# Altium schematic sheet 12V_REG.SchDoc
size A4; SheetNumber: 5; SheetTotal: 9
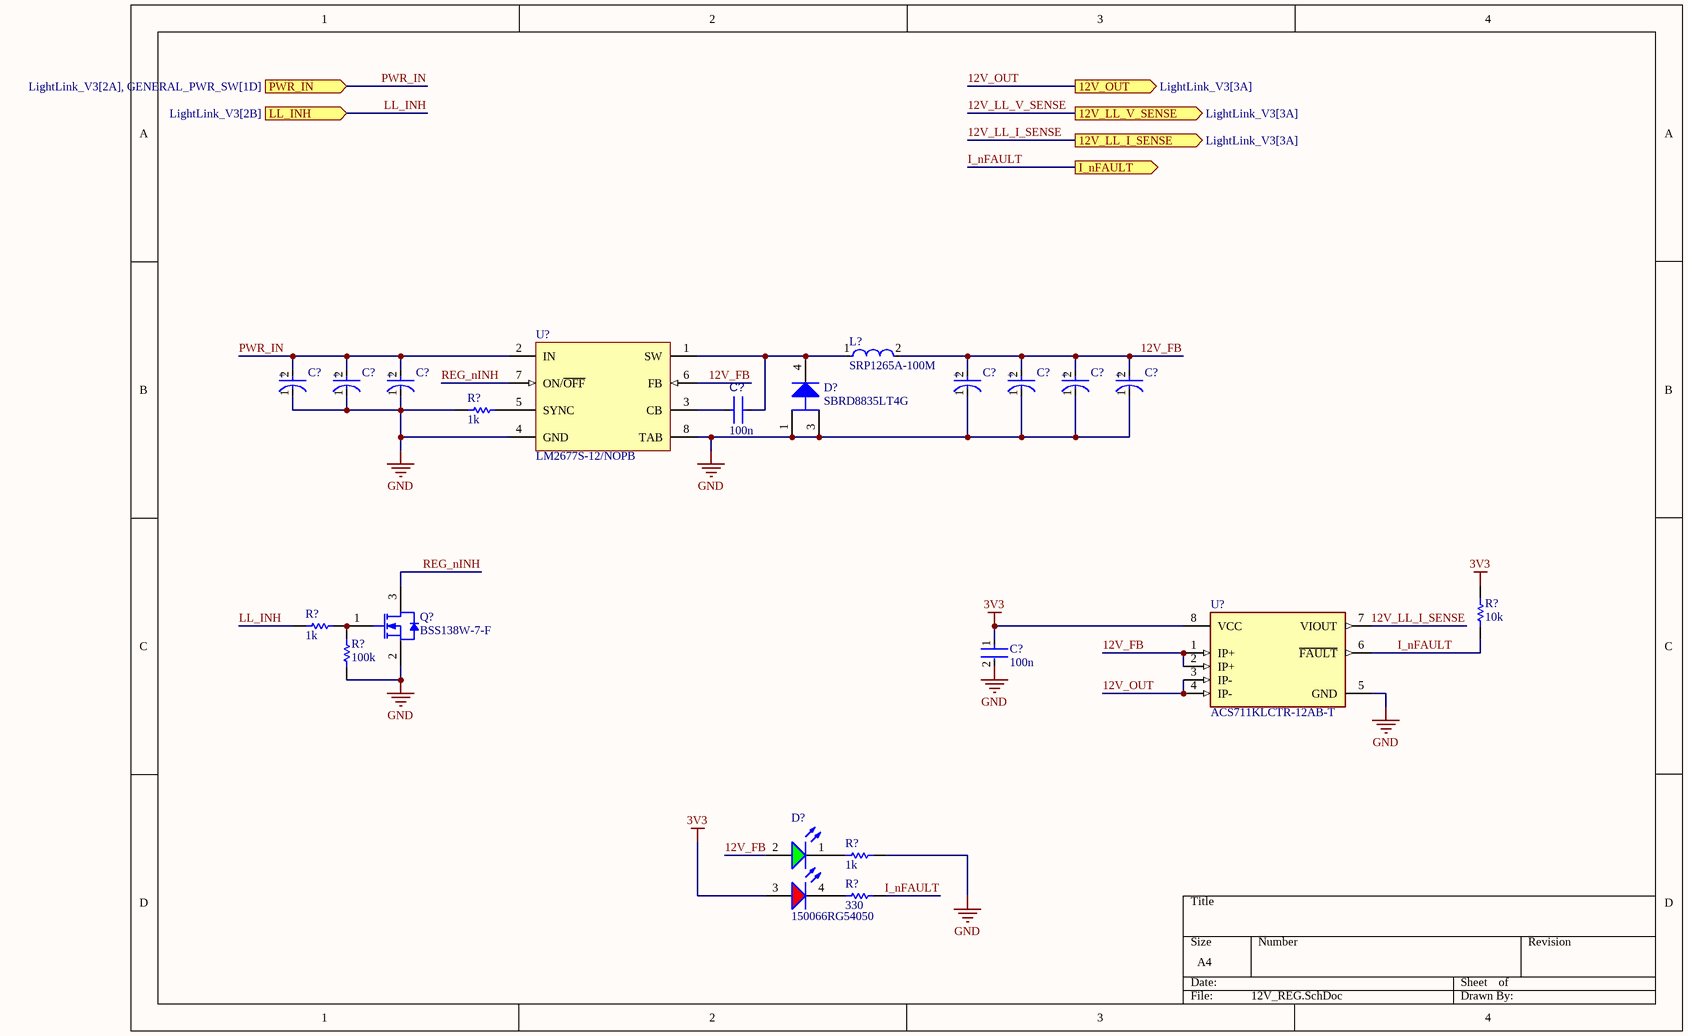
[diagram p0: 12V_REG.SchDoc]

## Parts
(Parts that share a designator on the sheet are numbered #1, #2 ... from top to bottom, then left to right.)
C?#1  TPSE686K025R0125  [FP-TPSE-MFG]  (value not drawn)
C?#2  TPSE686K025R0125  [FP-TPSE-MFG]  (value not drawn)
C?#3  TPSE686K025R0125  [FP-TPSE-MFG]  (value not drawn)
C?#4  T495D107K016ATE125  [FP-T495D107K016ATE125-MFG]  (value not drawn)
C?#5  T495D107K016ATE125  [FP-T495D107K016ATE125-MFG]  (value not drawn)
C?#6  T495D107K016ATE125  [FP-T495D107K016ATE125-MFG]  (value not drawn)
C?#7  T495D107K016ATE125  [FP-T495D107K016ATE125-MFG]  (value not drawn)
C?#8  100n  [C0402B]
C?#9  100n  [FP-0402-L_1_0_0_05-W_0_5-IPC_A]
D?#1  SBRD8835LT4G  [ONSC-DPAK-3-369C-01_V]
D?#2  150066RG54050  [WL-SBCD_0606]
L?  SRP1265A-100M  [FP-SRP1265A-100M-MFG]
Q?  BSS138W-7-F  [DIOD-SOT323-3_V]
R?#1  1k  [R0603B]
R?#2  10k  [R0603B]
R?#3  1k  [R0603B]
R?#4  100k  [R0603B]
R?#5  1k  [R0603B]
R?#6  330  [R0603B]
U?#1  LM2677S-12/NOPB  [KTW0007B_M]
U?#2  ACS711KLCTR-12AB-T  [FP-LC-8-IPC_C]

## Ports
12V_LL_I_SENSE (out, see LightLink_V3[3A]), 12V_LL_V_SENSE (out, see LightLink_V3[3A]), 12V_OUT (out, see LightLink_V3[3A]), I_nFAULT (out), LL_INH (in, see LightLink_V3[2B]), PWR_IN (in, see LightLink_V3[2A], GENERAL_PWR_SW[1D])

## Nets
3V3: C?#9.1 D?#2.3(A) R?#2.1 U?#2.8(VCC)
GND: C?#1.1(C) C?#2.1(C) C?#3.1(C) C?#4.1(C) C?#5.1(C) C?#6.1(C) C?#7.1(C) C?#9.2 D?#1.1(A) D?#1.3(A) Q?.2(S) R?#1.2 R?#4.2 R?#5.1 U?#1.4(GND) U?#1.8(TAB) U?#2.5(GND)
12V_FB: C?#4.2(A) C?#5.2(A) C?#6.2(A) C?#7.2(A) D?#2.2(A) L?.2 U?#1.6(FB) U?#2.1(IP+) U?#2.2(IP+)
12V_LL_I_SENSE: U?#2.7(VIOUT) ; port 12V_LL_I_SENSE
12V_LL_V_SENSE: port 12V_LL_V_SENSE
12V_OUT: U?#2.3(IP-) U?#2.4(IP-) ; port 12V_OUT
I_nFAULT: R?#2.2 R?#6.1 U?#2.6(~{FAULT}) ; port I_nFAULT
LL_INH: R?#3.2 ; port LL_INH
PWR_IN: C?#1.2(A) C?#2.2(A) C?#3.2(A) U?#1.2(IN) ; port PWR_IN
REG_nINH: Q?.3(D) U?#1.7(ON/~{OFF})
NetC?#8_1: C?#8.1 D?#1.4(K) L?.1 U?#1.1(SW)
NetC?#8_2: C?#8.2 U?#1.3(CB)
NetD?#2_1: D?#2.1(K) R?#5.2
NetD?#2_4: D?#2.4(K) R?#6.2
NetQ?_1: Q?.1(G) R?#3.1 R?#4.1
NetR?#1_1: R?#1.1 U?#1.5(SYNC)

## Notes on the sheet
- (in symbol CMP-2000-07207-2) +
- (in symbol CMP-04424-000178-1) +

## Library data of the parts
C?#1-C?#3 = CMP-04424-000178-1: CAP TANT 68UF 10% 25V 2917; Leakage Current: 17uA; Dielectric Material: Tantalum; Dissipation Factor: 6%; Ripple Current: 460uA; Polarity: Polar; ESR (Equivalent Series Resistance): 125mR; Mount: Surface Mount; Voltage Rating: 25V; Min Operating Temperature: -55°C; Case Code (Imperial): 2917; RoHS Compliant: Yes; Depth: 4.3mm; Lead Free: Lead Free; Number of Pins: 2; Width: 4.3mm; Series: TPS; Radiation Hardening: No; Height - Seated (Max): 0.169inch; Capacitance: 68uF; Case Code (Metric): 7343; Length: 7.3mm; Max Operating Temperature: 125°C; Packaging: Tape and Reel; Case/Package: 2917; Package Quantity: 1; Features: General Purpose; Voltage: 25V; REACH SVHC: No SVHC; Tolerance: 10%; Voltage Rating (DC): 25V; Height: 4.1mm; Termination: SMD/SMT
C?#4-C?#7 = CMP-2000-07207-2: CAP TANT 100UF 10% 16V 2917; Life (Hours): 2000Hour; ESR (Equivalent Series Resistance): 125mR; Polarity: Polar; Dielectric Material: Tantalum; Dissipation Factor: 8%; Capacitance: 100uF; Radiation Hardening: No; RoHS Compliant: Yes; Length: 7.3mm; Features: General Purpose; Packaging: Tape and Reel; Package Quantity: 1; Weight: 0.023634oz; Voltage Rating: 16V; Width: 0.169inch; Case/Package: 2917; Mount: Surface Mount; Voltage: 16V; Min Operating Temperature: -55°C; Tolerance: 10%; REACH SVHC: No SVHC; Height - Seated (Max): 0.122inch; Number of Pins: 2; Construction: Flat; Depth: 4.3mm; Series: T495; Max Operating Temperature: 125°C; Failure Rate: 0.001%; Termination: SMD/SMT; Voltage Rating (DC): 16V; Case Code (Imperial): 2917; Case Code (Metric): 7343; Height: 2.8mm
C?#8 = CMP-001-00000-11: Non-polarized capacitor
C?#9 = CMP-001-00058-1: LARGE PADS, 0402 CAP, CHANGE COMMENT TO MATCH REAL P/N; Capacitor Type: Ceramic; Min Operating Temperature: -55°C; Mounting Technology: Surface Mount; Pins: 2; Case/Package: 0402; RoHS Compliant: Yes; Max Operating Temperature: 85°C
D?#1 = CMP-1055-00170-1: SWITCHMODE(TM) Power Rectifier, 3-Pin DPAK, Pb-Free, Tape and Reel; Manufacturer: On Semiconductor; Configuration: Single; IFSM Max (A): 75; PackageReference: DPAK-3-369C-01; PackageDescription: 3-Pin Flange Mount, Body 6.54 x 6.095 mm, Pitch 2.29 mm; ComponentLink3URL: http://www.onsemi.cn/pub_link/Collateral/369C.PDF; DatasheetVersion: Rev. 11; ComponentLink2URL: http://www.onsemi.cn/pub_link/Collateral/MBRD835L-D.PDF; Mounting Technology: Surface Mount; ComponentLink3Description: Package Specification; PackageVersion: Rev. E, 02/2014; ComponentLink1Description: Manufacturer URL; RoHS: TRUE; ComponentLink2Description: Datasheet; ComponentLink1URL: http://www.onsemi.com/; PartNumber: SBRD8835LT4G; Packing: Tape and Reel
D?#2 = CMP-004-00040-2: Led, Red/Grn, 180Mcd/230Mcd, 624Nm/525Nm Rohs Compliant: Yes; Source: rgled.SchLib; Component Type: Standard; Design Item ID: CMP-004-00034-2; Pins: 4
L? = CMP-07248-000069-1: FIXED IND 10UH 10A 16.5 MOHM SMD; Shielding: Shielded; Self Resonant Frequency: 10MHz; Test Frequency: 100kHz; Q Factor: 20; Saturation Current: 15.5A; Tolerance: 20%; Core Material: Carbonyl Powder; DC Resistance (DCR): 16.5mR; REACH SVHC: No SVHC; Case/Package: Nonstandard; Length: 13.5mm; RMS Current (Irms): 10A; Termination: SMD/SMT; Max DC Current: 10A; Ratings: AEC-Q200; Max Operating Temperature: 150°C; Height: 6.2mm; Resistor Type: Wirewound; Min Operating Temperature: -40°C; Mount: Surface Mount; Packaging: Cut Tape; Depth: 12.5mm; Package Quantity: 500; RoHS Compliant: Yes; Current Rating: 10A; Inductance Tolerance: 20%; Width: 0.492inch; Height - Seated (Max): 0.252inch; Inductance: 10uH
Q? = CMP-2000-05968-1: N-Channel Enhancement Mode Mosfet, 50 V, 200 mA, -55 to 150 degC, 6-Pin SOT-323, RoHS, Tape and Reel; Typical Turn-Off Delay Time: 20ns; Number of Channels: 1Channel; Type: EnhancementModeFieldEffectTransistor; Brand: DiodesIncorporated; Vds - Drain-Source Breakdown Voltage: 75V; Vgs - Gate-Source Voltage: 20V; Rds On - Drain-Source Resistance: 1.4Ohms; Transistor Type: 1N-Channel; Configuration: Single; Unit Weight: 0.000212oz; Pd - Power Dissipation: 200mW; Id - Continuous Drain Current: 200mA; Forward Transconductance - Min: 0.1S; Manufacturer URL: http://www.diodes.com/; Series: BSS138; Package Description: 3-Pin Small Outline Transistor, Body 2 x 1.25 mm, Pitch 0.65 mm; Mounting Technology: SurfaceMount; Product Category: MOSFET; RoHS: True; Maximum Operating Temperature: +150C; Height: 1mm; Length: 2.2mm; Technology: Si; Width: 1.35mm; Datasheet URL: http://www.diodes.com/_files/datasheets/ds30206.pdf; Manufacturer: DiodesIncorporated; Package / Case: SOT-323-3; Typical Turn-On Delay Time: 20ns; Transistor Polarity: N-Channel; Factory Pack Quantity: 3000; Packaging: Reel; Product: MOSFETSmallSignal; Datasheet Version: Rev. 11-2, 09/2013; Package Reference: SOT323; Minimum Operating Temperature: -55C; Mounting Style: SMD/SMT; Channel Mode: Enhancement
R?#1-R?#6 = CMP-009-00002-14: Resistor
  R?#1 R?#3 R?#5: Value: 1k
  R?#2: Value: 10k
  R?#4: Value: 100k
  R?#6: Value: 330
U?#1 = CMP-0069-00198-3: SIMPLE SWITCHER® High Efficiency 5A Step-Down Voltage Regulator with Sync, 7-pin TO-263, Pb-Free; Manufacturer: Texas Instruments; PowerWise: N; PackageTopMarking: NSUZXYTTE#*LM2677S*-12; ComponentLink1URL: http://www.ti.com/general/docs/lit/getliterature.tsp?genericPartNumber=LM2677&fileType=pdf; Code_JEDEC: MO-169-AC; CompType: Switcher; ComponentLink1Description: Datasheet URL; PackageDescription: TO-263, Molded, .400 x .390 x .180in Body, 7 Lead, .050in Pitch, Surface Mount; PackageReference: KTW0007B; RoHS: Y; PinCount: 7
U?#2 = CMP-1557-00012-2: SENSOR CURRENT HALL 12.5A AC/DC; Number of Channels: 1; Min Supply Voltage: 3V; Sensitivity: 110mV/A; Response Time: 4.6us; Operating Supply Voltage: 3.3V; Max Supply Voltage: 5.5V; Max Supply Current: 5.5mA; Bandwidth: 100kHz; Linearity: 1%; Quiescent Current: 4mA; Accuracy: 5%; Polarity: Bidirectional; Case/Package: SOIC; Packaging: Tape and Reel; Number of Pins: 8; Width: 3.9mm; Frequency: 100kHz; -3db Bandwidth: 100kHz; REACH SVHC: No SVHC; Series: -; Height: 1.5mm; Package Quantity: 1; Min Operating Temperature: -40°C; Max Operating Temperature: 125°C; Current Sensing: 12.5A; RoHS Compliant: Yes; Length: 4.9mm